# Altium schematic sheet SchematicDesign.SchDoc
size A4
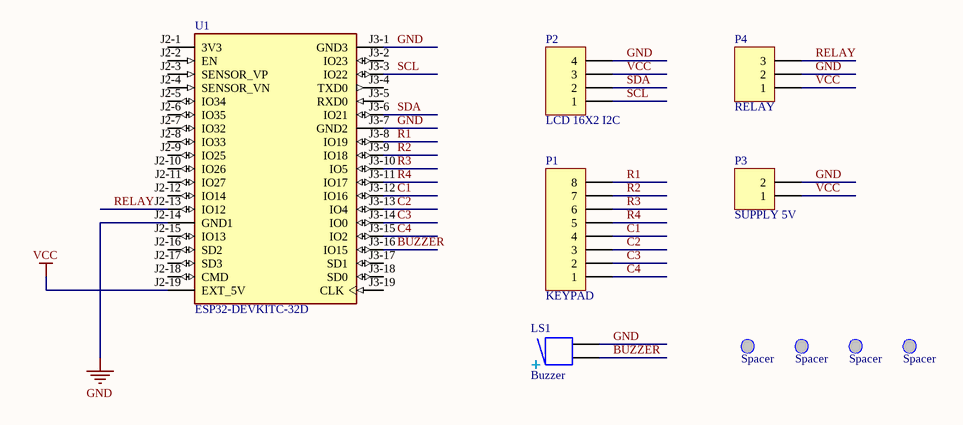
[diagram p0: SchematicDesign.SchDoc]

## Parts
1  Spacer  [Spacer]
2  Spacer  [Spacer]
3  Spacer  [Spacer]
4  Spacer  [Spacer]
LS1  Buzzer  [BUZZER]
P1  KEYPAD  [HDR1X8]
P2  LCD 16X2 I2C  [HDR1X4]
P3  SUPPLY 5V  [Term.Block 2pin]
P4  RELAY  [HDR1X3]
U1  ESP32-DEVKITC-32D  [MODULE_ESP32-DEVKITC-32D]

## Nets
GND: LS1.2 P2.4 P3.1(2) P4.2 U1.J2-14(GND1) U1.J3-1(GND3) U1.J3-7(GND2)
VCC: P2.3 P3.0(1) P4.1 U1.J2-19(EXT_5V)
BUZZER: LS1.1 U1.J3-16(IO15)
C1: P1.4 U1.J3-12(IO16)
C2: P1.3 U1.J3-13(IO4)
C3: P1.2 U1.J3-14(IO0)
C4: P1.1 U1.J3-15(IO2)
R1: P1.8 U1.J3-8(IO19)
R2: P1.7 U1.J3-9(IO18)
R3: P1.6 U1.J3-10(IO5)
R4: P1.5 U1.J3-11(IO17)
RELAY: P4.3 U1.J2-13(IO12)
SCL: P2.1 U1.J3-3(IO22)
SDA: P2.2 U1.J3-6(IO21)

Not connected (* = marked no-connect by the designer): U1 J2-1(3V3) J2-2(EN) J2-3(SENSOR_VP) J2-4(SENSOR_VN) J2-5(IO34) J2-6(IO35) J2-7(IO32) J2-8(IO33) J2-9(IO25) J2-10(IO26) J2-11(IO27) J2-12(IO14) J2-15(IO13) J2-16(SD2) J2-17(SD3) J2-18(CMD) J3-2(IO23) J3-4(TXD0) J3-5(RXD0) J3-17(SD1) J3-18(SD0) J3-19(CLK)

## Library data of the parts
LS1 = Buzzer: Magnetic Transducer Buzzer; Published: 24-Mar-1999; LatestRevisionDate: 17-Dec-2003; LatestRevisionNote: Schematic revised, PCB Footprint replaced.; DatasheetVersion: 17-Dec-2003; PackageReference: ABSM-1574; Publisher: Altium Limited; PackageDescription: Magnetic Transducer Buzzer; ComponentLink1Description: Manufacturer Link; ComponentLink1URL: http://www.megastar.com/linecard/buzzmode/index.php
P1 = Header 8: Header, 8-Pin; LatestRevisionDate: 17-Jul-2002; LatestRevisionNote: Re-released for DXP Platform.; Publisher: Altium Limited
P2 = Header 4: Header, 4-Pin; LatestRevisionDate: 17-Jul-2002; LatestRevisionNote: Re-released for DXP Platform.; Publisher: Altium Limited
P3 = Term.Block 2pin: Term.Block, 2-Pin; LatestRevisionDate: 17-Jul-2002; LatestRevisionNote: Re-released for DXP Platform.; Publisher: Altium Limited
P4 = Header 3: Header, 3-Pin; LatestRevisionDate: 17-Jul-2002; LatestRevisionNote: Re-released for DXP Platform.; Publisher: Altium Limited
U1 = ESP32-DEVKITC-32D: WiFi Development Tools (802.11) ESP32 General Development Kit, ESP32-WROOM-32D on the board; MF: Espressif Systems; SnapEDA_Link: https://www.snapeda.com/parts/ESP32-DEVKITC-32D/Espressif+Systems/view-part/?ref=snap; Package: None; Value: *; MP: ESP32-DEVKITC-32D; Check_prices: https://www.snapeda.com/parts/ESP32-DEVKITC-32D/Espressif+Systems/view-part/?ref=eda
1-4 = Spacer: Published: 8-Jun-2000; LatestRevisionDate: 17-Jul-2002; LatestRevisionNote: Re-released for DXP Platform.; PackageReference: R38; Publisher: Altium Limited; PackageDescription: Crystal, Thru-Hole; 2 Leads; Body 3.1 x 8.2 mm (Dia.xH)